# EAGLE board Shifter (EAGLE 9.4.2), part 1 of 2
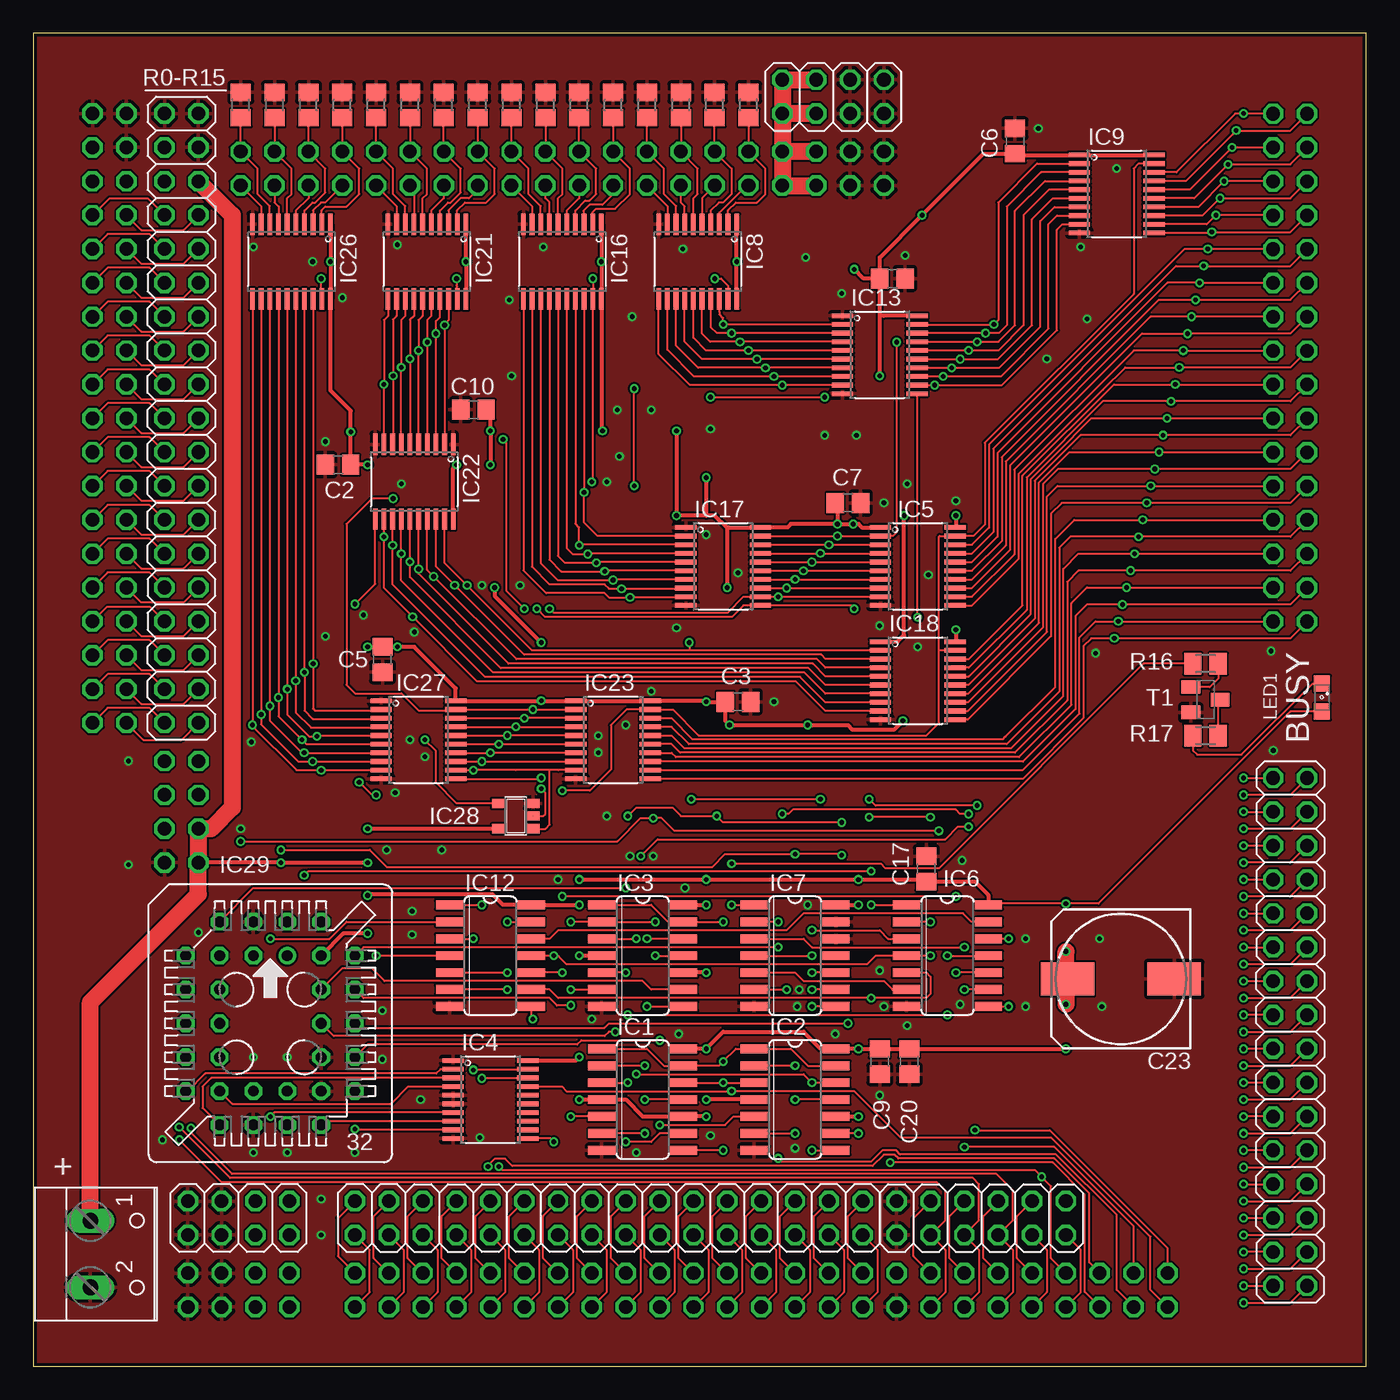
[diagram p2: board, top side]
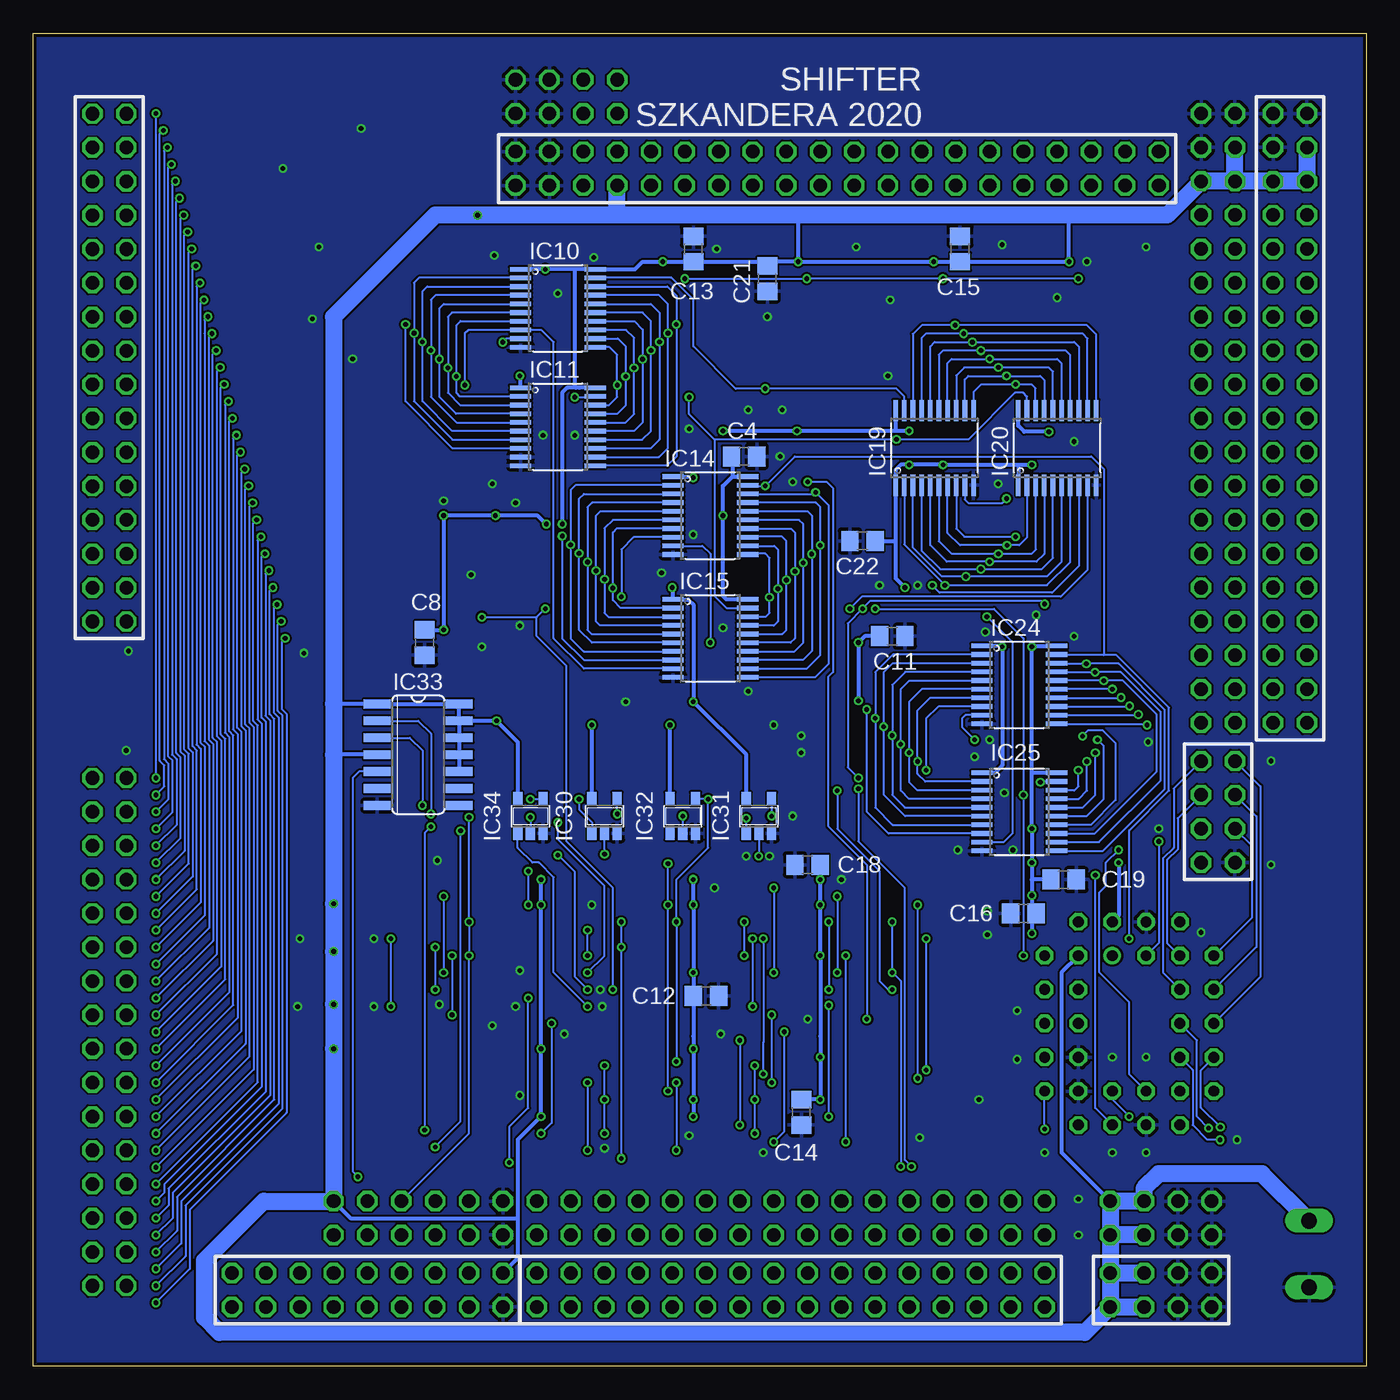
[diagram p3: board, bottom side, seen from below]

Size 100 x 100 mm. Coordinates in mm from the lower left corner, seen from the top.
Outline: 0,0 100,0 100,100 0,100 0,0
Copper layers (1*16): Top 0.035mm / dielectric 1.5mm / Bottom 0.035mm
Design rules "SeeedStudio_2layer_DRU_no_angle_20140221": minimum track width 6mil, minimum drill 12mil, track to track 6mil, track to pad 6mil, pad to pad 6mil, via to via 6mil, smd to smd 0mil, copper to edge 10mil, drill to drill 10mil, minimum pad ring 10mil, minimum via ring 6mil, stop-mask expansion 2mil, vias tented up to drill 100mil, thermal gap 10mil

## Footprints (pad centres in the part's own frame; a part is rotated, then mirrored left to right if it is on the bottom)
2X16 = drill 1.016 octagon: 1 -19.05,-1.27; 2 -19.05,1.27; 3 -16.51,-1.27; 4 -16.51,1.27; 5 -13.97,-1.27; 6 -13.97,1.27; 7 -11.43,-1.27; 8 -11.43,1.27; 9 -8.89,-1.27; 10 -8.89,1.27; 11 -6.35,-1.27; 12 -6.35,1.27; 13 -3.81,-1.27; 14 -3.81,1.27; 15 -1.27,-1.27; 16 -1.27,1.27; 17 1.27,-1.27; 18 1.27,1.27; 19 3.81,-1.27; 20 3.81,1.27; 21 6.35,-1.27; 22 6.35,1.27; 23 8.89,-1.27; 24 8.89,1.27; 25 11.43,-1.27; 26 11.43,1.27; 27 13.97,-1.27; 28 13.97,1.27; 29 16.51,-1.27; 30 16.51,1.27; 31 19.05,-1.27; 32 19.05,1.27
2X04 = drill 1.016 octagon: 1 -3.81,-1.27; 2 -3.81,1.27; 3 -1.27,-1.27; 4 -1.27,1.27; 5 1.27,-1.27; 6 1.27,1.27; 7 3.81,-1.27; 8 3.81,1.27
C0805 = smd 1.3 x 1.5: 1 -0.95,0; 2 0.95,0
153CLV-1010 = smd 4 x 2.5: + 4,0; - -4,0
SO14 = smd 0.66 x 2.032: 1 -3.81,-3.073; 2 -2.54,-3.073; 3 -1.27,-3.073; 4 0,-3.073; 5 1.27,-3.073; 6 2.54,-3.073; 7 3.81,-3.073; 8 3.81,3.073; 9 2.54,3.073; 10 1.27,3.073; 11 0,3.073; 12 -1.27,3.073; 13 -2.54,3.073; 14 -3.81,3.073
TSSOP20 = smd 0.35 x 1.6: 1 -2.925,-2.8; 2 -2.275,-2.8; 3 -1.625,-2.8; 4 -0.975,-2.8; 5 -0.325,-2.8; 6 0.325,-2.8; 7 0.975,-2.8; 8 1.625,-2.8; 9 2.275,-2.8; 10 2.925,-2.8; 11 2.925,2.8; 12 2.275,2.8; 13 1.625,2.8; 14 0.975,2.8; 15 0.325,2.8; 16 -0.325,2.8; 17 -0.975,2.8; 18 -1.625,2.8; 19 -2.275,2.8; 20 -2.925,2.8
SOT23-5 = smd 0.69 x 0.99: 1 -0.95,-1.29; 2 0,-1.29; 3 0.95,-1.29; 4 0.95,1.3; 5 -0.95,1.3
S32 = drill 0.813: 1 1.27,5.08 | drill 0.813 octagon: 2 -1.27,7.62; 3 -1.27,5.08; 4 -3.81,7.62; 5 -6.35,5.08; 6 -3.81,5.08; 7 -6.35,2.54; 8 -3.81,2.54; 9 -6.35,0; 10 -3.81,0; 11 -6.35,-2.54; 12 -3.81,-2.54; 13 -6.35,-5.08; 14 -3.81,-7.62; 15 -3.81,-5.08; 16 -1.27,-7.62; 17 -1.27,-5.08; 18 1.27,-7.62; 19 1.27,-5.08; 20 3.81,-7.62; 21 6.35,-5.08; 22 3.81,-5.08; 23 6.35,-2.54; 24 3.81,-2.54; 25 6.35,0; 26 3.81,0; 27 6.35,2.54; 28 3.81,2.54; 29 6.35,5.08; 30 3.81,7.62; 31 3.81,5.08; 32 1.27,7.62
2X09 = drill 1.016 octagon: 1 -10.16,-1.27; 2 -10.16,1.27; 3 -7.62,-1.27; 4 -7.62,1.27; 5 -5.08,-1.27; 6 -5.08,1.27; 7 -2.54,-1.27; 8 -2.54,1.27; 9 0,-1.27; 10 0,1.27; 11 2.54,-1.27; 12 2.54,1.27; 13 5.08,-1.27; 14 5.08,1.27; 15 7.62,-1.27; 16 7.62,1.27; 17 10.16,-1.27; 18 10.16,1.27
2X06 = drill 1.016 octagon: 1 -6.35,-1.27; 2 -6.35,1.27; 3 -3.81,-1.27; 4 -3.81,1.27; 5 -1.27,-1.27; 6 -1.27,1.27; 7 1.27,-1.27; 8 1.27,1.27; 9 3.81,-1.27; 10 3.81,1.27; 11 6.35,-1.27; 12 6.35,1.27
SML0805 = smd 1.2 x 1.2: A 1.05,0; C -1.05,0
R0805 = smd 1.3 x 1.5: 1 -0.95,0; 2 0.95,0
M0805 = smd 1.3 x 1.6: 1 -0.95,0; 2 0.95,0
2X20 = drill 1.016 octagon: 1 -24.13,-1.27; 2 -24.13,1.27; 3 -21.59,-1.27; 4 -21.59,1.27; 5 -19.05,-1.27; 6 -19.05,1.27; 7 -16.51,-1.27; 8 -16.51,1.27; 9 -13.97,-1.27; 10 -13.97,1.27; 11 -11.43,-1.27; 12 -11.43,1.27; 13 -8.89,-1.27; 14 -8.89,1.27; 15 -6.35,-1.27; 16 -6.35,1.27; 17 -3.81,-1.27; 18 -3.81,1.27; 19 -1.27,-1.27; 20 -1.27,1.27; 21 1.27,-1.27; 22 1.27,1.27; 23 3.81,-1.27; 24 3.81,1.27; 25 6.35,-1.27; 26 6.35,1.27; 27 8.89,-1.27; 28 8.89,1.27; 29 11.43,-1.27; 30 11.43,1.27; 31 13.97,-1.27; 32 13.97,1.27; 33 16.51,-1.27; 34 16.51,1.27; 35 19.05,-1.27; 36 19.05,1.27; 37 21.59,-1.27; 38 21.59,1.27; 39 24.13,-1.27; 40 24.13,1.27
2X19 = drill 1.016 octagon: 1 -22.86,-1.27; 2 -22.86,1.27; 3 -20.32,-1.27; 4 -20.32,1.27; 5 -17.78,-1.27; 6 -17.78,1.27; 7 -15.24,-1.27; 8 -15.24,1.27; 9 -12.7,-1.27; 10 -12.7,1.27; 11 -10.16,-1.27; 12 -10.16,1.27; 13 -7.62,-1.27; 14 -7.62,1.27; 15 -5.08,-1.27; 16 -5.08,1.27; 17 -2.54,-1.27; 18 -2.54,1.27; 19 0,-1.27; 20 0,1.27; 21 2.54,-1.27; 22 2.54,1.27; 23 5.08,-1.27; 24 5.08,1.27; 25 7.62,-1.27; 26 7.62,1.27; 27 10.16,-1.27; 28 10.16,1.27; 29 12.7,-1.27; 30 12.7,1.27; 31 15.24,-1.27; 32 15.24,1.27; 33 17.78,-1.27; 34 17.78,1.27; 35 20.32,-1.27; 36 20.32,1.27; 37 22.86,-1.27; 38 22.86,1.27
SOT23-BEC = smd 1 x 1.4: B -0.95,-1.1; C 0,1.1; E 0.95,-1.1
W237-102 = drill 1.194 long: 1 -2.5,-1.27; 2 2.5,-1.27

## Placement (x,y rotation side)
ALU_O_C0  [2X16]  43.18,11.11 180 top
ALU_O_C1  [2X16]  43.18,5.71 180 top
ALU_Y_C0  [2X04]  11.11,41.59 270 top
C1  [C0805]  64.45,81.6 0 top
C2  [C0805]  22.86,67.63 180 top
C3  [C0805]  52.86,49.85 0 top
C4  [C0805]  46.67,68.26 0 bottom
C5  [C0805]  26.19,53.02 270 top
C6  [C0805]  73.66,91.92 90 top
C7  [C0805]  61.12,64.77 0 top
C8  [C0805]  70.64,54.29 270 bottom
C9  [C0805]  63.5,22.86 270 top
C10  [C0805]  33.02,71.75 180 top
C11  [C0805]  35.56,54.77 0 bottom
C12  [C0805]  49.53,27.78 0 bottom
C13  [C0805]  50.48,83.82 90 bottom
C14  [C0805]  42.39,19.05 270 bottom
C15  [C0805]  30.48,83.82 90 bottom
C16  [C0805]  25.72,33.97 180 bottom
C17  [C0805]  66.99,37.31 90 top
C18  [C0805]  41.91,37.62 180 bottom
C19  1u  [C0805]  22.7,36.51 0 bottom
C20  1u  [C0805]  65.72,22.86 270 top
C21  1u  [C0805]  44.93,81.6 270 bottom
C22  1u  [C0805]  37.78,61.91 180 bottom
C23  [153CLV-1010]  81.6,29.05 180 top
IC1  74AC74D  [SO14]  45.72,20 270 top
IC2  74AC74D  [SO14]  57.15,20 270 top
IC3  74AC74D  [SO14]  45.72,30.8 270 top
IC4  74574  [TSSOP20]  34.29,20 270 top
IC5  74245  [TSSOP20]  66.36,60.01 270 top
IC6  74HCT08D  [SO14]  68.58,30.8 270 top
IC7  74HCT32D  [SO14]  57.15,30.8 270 top
IC8  74245  [TSSOP20]  49.85,82.87 180 top
IC9  74245  [TSSOP20]  81.28,87.95 270 top
IC10  74245  [TSSOP20]  60.64,79.38 270 bottom
IC11  74245  [TSSOP20]  60.64,70.48 270 bottom
IC12  74HCT04D  [SO14]  34.29,30.8 270 top
IC13  74574  [TSSOP20]  63.5,75.88 270 top
IC14  74245  [TSSOP20]  49.21,63.82 270 bottom
IC15  74245  [TSSOP20]  49.21,54.61 270 bottom
IC16  74245  [TSSOP20]  39.69,82.87 180 top
IC17  74574  [TSSOP20]  51.75,60.01 270 top
IC18  74245  [TSSOP20]  66.36,51.44 270 top
IC19  74245  [TSSOP20]  32.38,68.9 0 bottom
IC20  74245  [TSSOP20]  23.18,68.9 0 bottom
IC21  74245  [TSSOP20]  29.53,82.87 180 top
IC22  74574  [TSSOP20]  28.57,66.36 180 top
IC23  74245  [TSSOP20]  43.5,46.99 270 top
IC24  74245  [TSSOP20]  26.04,51.12 270 bottom
IC25  74245  [TSSOP20]  26.04,41.59 270 bottom
IC26  74245  [TSSOP20]  19.37,82.87 180 top
IC27  74574  [TSSOP20]  28.89,46.99 270 top
IC28  74AHC1G08DBV  [SOT23-5]  36.2,41.27 90 top
IC29  [S32]  17.78,25.72 0 top
IC30  74HCT1G08  [SOT23-5]  57.15,41.27 0 bottom
IC31  74AHC1G32DBV  [SOT23-5]  45.56,41.27 0 bottom
IC32  74AHC1G04DBV  [SOT23-5]  51.28,41.27 0 bottom
IC33  74HCT74D  [SO14]  71.12,45.88 270 bottom
IC34  74HCT1G08  [SOT23-5]  62.71,41.27 0 bottom
JP5  [2X09]  74.93,5.71 0 top
JP8  PINHD-2X6  [2X06]  71.12,11.11 0 top
LED1  [SML0805]  96.68,50.16 270 top
PWR_C0  [2X04]  60.01,95.25 0 top
PWR_C1  [2X04]  15.4,11.11 180 top
PWR_C2  [2X04]  15.4,5.71 180 top
R0  [R0805]  53.66,94.61 90 top
R1  [R0805]  51.12,94.61 90 top
R2  [R0805]  48.58,94.61 90 top
R3  [R0805]  46.04,94.61 90 top
R4  [R0805]  43.5,94.61 90 top
R5  [R0805]  40.96,94.61 90 top
R6  [R0805]  38.42,94.61 90 top
R7  [R0805]  35.88,94.61 90 top
R8  [R0805]  33.34,94.61 90 top
R9  [R0805]  30.8,94.61 90 top
R10  [R0805]  28.26,94.61 90 top
R11  [R0805]  25.72,94.61 90 top
R12  [R0805]  23.18,94.61 90 top
R13  [R0805]  20.64,94.61 90 top
R14  [R0805]  18.1,94.61 90 top
R15  [R0805]  15.56,94.61 90 top
R16  10k  [M0805]  87.95,52.7 0 top
R17  10k  [M0805]  87.95,47.31 180 top
RB0_C0  [2X20]  39.69,89.85 180 top
RB1_C0  [2X19]  5.71,71.12 270 top
RB1_C1  [2X19]  11.11,71.12 270 top
RTB_C0  [2X16]  94.3,74.92 270 top
RTB_C1  [2X16]  94.3,25.08 270 top
T1  [SOT23-BEC]  87.95,50.01 270 top
X1  [W237-102]  5.56,8.41 270 top